# Altium schematic sheet Interface.SchDoc
size A4; SheetNumber: 4; SheetTotal: 4
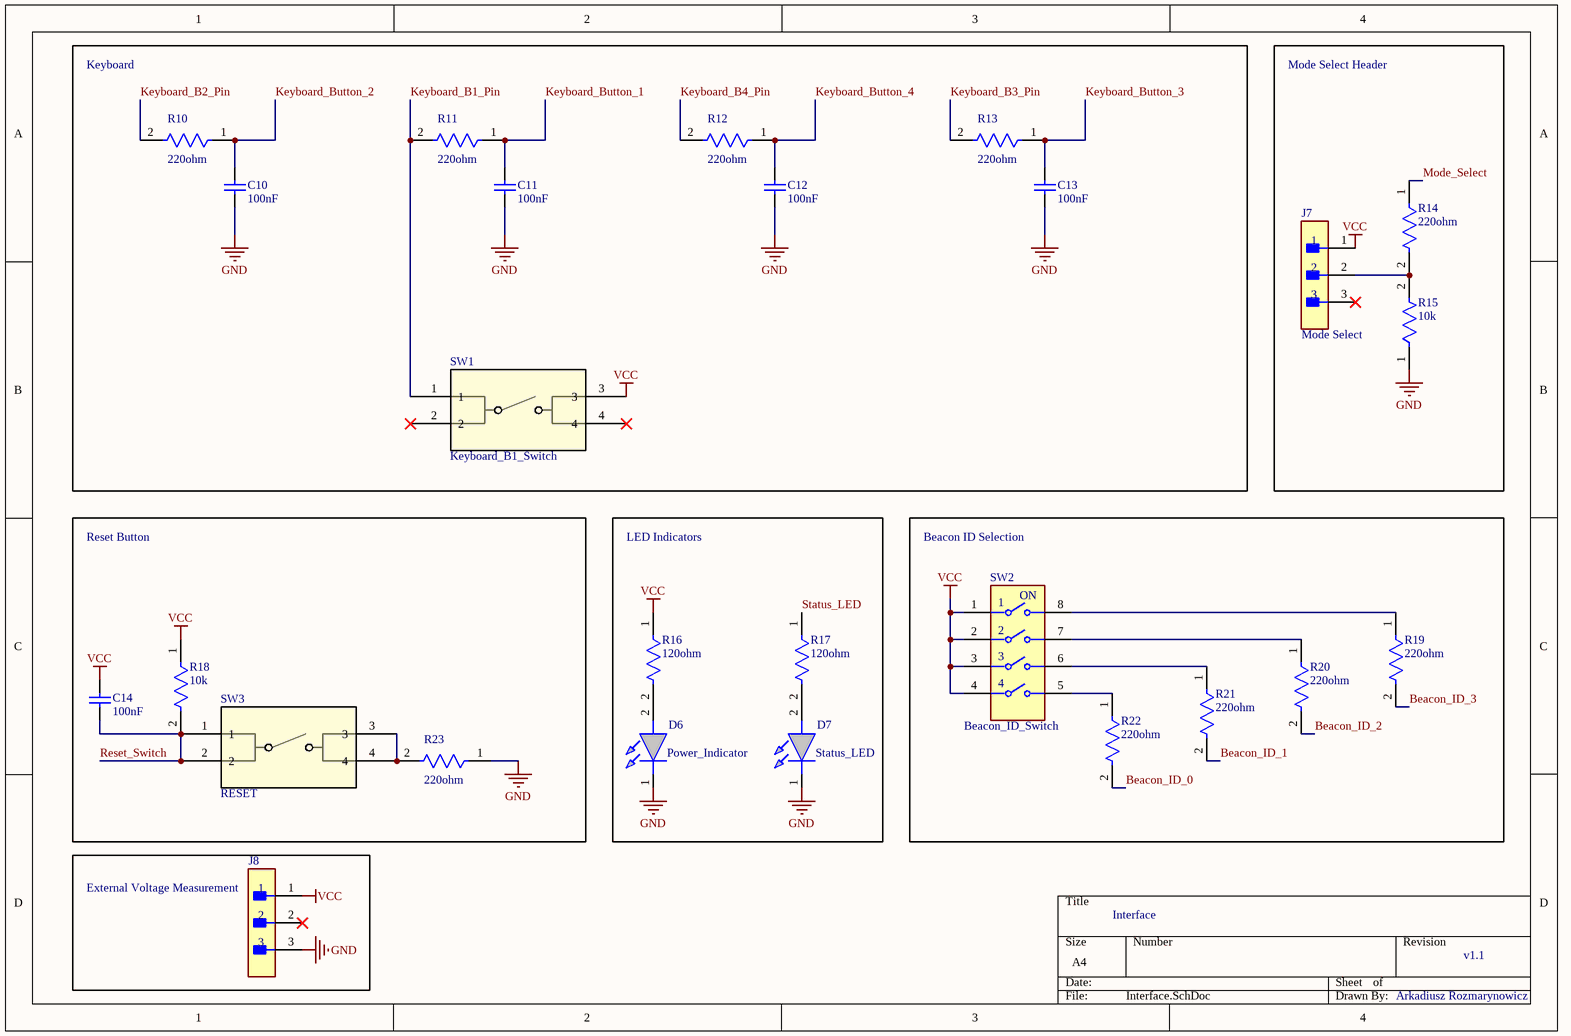
[diagram p0: Interface.SchDoc]

## Parts
C10  100nF  [CAPC2013X145X48NL20T23]
C11  100nF  [CAPC2013X145X48NL20T23]
C12  100nF  [CAPC2013X145X48NL20T23]
C13  100nF  [CAPC2013X145X48NL20T23]
C14  100nF  [CAPC2013X145X48NL20T23]
D6  Power_Indicator  [LEDC2012X40N]
D7  Status_LED  [LEDC2012X40N]
J7  Mode Select  [FP-TMM-103-03-T-S-MFG]
J8  External Voltage Measurement  [FP-TMM-103-03-T-S-MFG]
R10  220ohm  [FP-CRGCQ0805-IPC_C]
R11  220ohm  [FP-CRGCQ0805-IPC_C]
R12  220ohm  [FP-CRGCQ0805-IPC_C]
R13  220ohm  [FP-CRGCQ0805-IPC_C]
R14  220ohm  [FP-CRGCQ0805-IPC_C]
R15  10k  [FP-CRGCQ0805-IPC_C]
R16  120ohm  [FP-CRGCQ0805-IPC_C]
R17  120ohm  [FP-CRGCQ0805-IPC_C]
R18  10k  [FP-CRGCQ0805-IPC_C]
R19  220ohm  [FP-CRGCQ0805-IPC_C]
R20  220ohm  [FP-CRGCQ0805-IPC_C]
R21  220ohm  [FP-CRGCQ0805-IPC_C]
R22  220ohm  [FP-CRGCQ0805-IPC_C]
R23  220ohm  [FP-CRGCQ0805-IPC_C]
SW1  Keyboard_B1_Switch  [SW4_FSM-5P23_TEC]
SW2  Beacon_ID_Switch  [FP-A6S-4104-H-MFG]
SW3  RESET  [SW4_FSM-5P23_TEC]

## Blocks framed on the sheet
Keyboard: C10-C13 R10-R13 SW1
Mode Select Header: J7 R14 R15
LED Indicators: D6 D7 R16 R17
Beacon ID Selection: R19-R22 SW2

## Nets
GND: C10.1 C11.1 C12.1 C13.1 D6.1(K) D7.1(K) J8.3 R15.1 R23.1
VCC: C14.2 J7.1 J8.1 R16.1 R18.1 SW1.3 SW2.1 SW2.2 SW2.3 SW2.4
Beacon_ID_0: R22.2
Beacon_ID_1: R21.2
Beacon_ID_2: R20.2
Beacon_ID_3: R19.2
Keyboard_B1_Pin: R11.2 SW1.1
Keyboard_B2_Pin: R10.2
Keyboard_B3_Pin: R13.2
Keyboard_B4_Pin: R12.2
Keyboard_Button_1: C11.2 R11.1
Keyboard_Button_2: C10.2 R10.1
Keyboard_Button_3: C13.2 R13.1
Keyboard_Button_4: C12.2 R12.1
Mode_Select: R14.1
Reset_Switch: C14.1 R18.2 SW3.1 SW3.2
Status_LED: R17.1
NetD6_2: D6.2(A) R16.2
NetD7_2: D7.2(A) R17.2
NetJ7_2: J7.2 R14.2 R15.2
NetR19_1: R19.1 SW2.8
NetR20_1: R20.1 SW2.7
NetR21_1: R21.1 SW2.6
NetR22_1: R22.1 SW2.5
NetR23_2: R23.2 SW3.3 SW3.4

Not connected (* = marked no-connect by the designer): J7 3*; J8 2*; SW1 2* 4*

## Notes on the sheet
- Reset Button
- Interface
- v1.1
- Arkadiusz Rozmarynowicz
- (in symbol CMP-08827-000006-1) ON

## Library data of the parts
C10-C14 = CMP-2007-01705-1: Part Number: VJ0805Y104KXAMR; Manufacturer: Vitramon
D6 D7 = LS_R976: Red 0805 CHIPLED LS R976N-R102 Osram Opto LS R976, CHIPLED 0805 Series Red LED, 633 nm, 2012 (0805), Rectangle Lens SMD Package; Manufacturer_Name: ams OSRAM; Manufacturer_Part_Number: LS R976; Geometry.Height: 0.4mm; Mouser Part Number: 720-LSR976D5178; Mouser Price/Stock: https://www.mouser.co.uk/ProductDetail/OSRAM-Opto-Semiconductors/LS-R976?qs=OIr7YF%252B2cWVTfzKl425Fkw%3D%3D; Arrow Part Number: LS R976; Arrow Price/Stock: https://www.arrow.com/en/products/lsr976/osram-opto-semiconductors?region=europe; Datasheet Link: http://uk.rs-online.com/web/p/products/4974804
J7 J8 = CMP-02766-001695-1: CONN HEADER VERT 3POS 2MM; Gender: Male; Number of Positions: 3; Max Current Rating: 3.9A; Max Voltage Rating (AC): 500V; Packaging: Bulk; RoHS Compliant: Yes; Mount: Through Hole; Length: 6mm; Contact Type: Male Pin; Package Quantity: 1; Depth: 1.97mm; Contact Material: Bronze; Insulation Material: Polymer; Series: TMM; Contact Plating: Tin; Fastening Type: Pull; Housing Color: Black; Pitch: 2mm; Termination: Solder; Contact Mating Length: 0.157inch; Min Operating Temperature: -55°C; REACH SVHC: No SVHC; Orientation: Straight; Number of Rows: 1; Color: Black; Insulation Color: Black; Connector Type: Header; Radiation Hardening: No; Number of Contacts: 3; Lead Free: Lead Free; Contact Finish - Mating: TIN; Max Operating Temperature: 105°C; Housing Material: Polymer; Contact Shape: Square
R10-R13 R23 = CMP-03211-009742-1: CRGCQ0805 100KΩ 0.125W ±100ppm/°C 5% 150V; Manufacturer Part Number: CRGCQ0805J100K; Manufacturer: TE Connectivity; Resistance: 1k; Tolerance: 0.05; Temperature Range High: +155°C; Automotive Grade: Grade 1142; RoHS: TRUE; Package: CRGCQ0805; Octopart: https://octopart.com/crgcq0805j100k-te+connectivity-91018199; Device Class L1: Passive Components; Lead Free: Yes; Temperature: -55°C to +155°C; Category: Res; ComponentLink2Description: Datasheet; Power Rating: 0.125W; Ambient Temperature Range High: +70°C; Composition: Thick Film; Temperature Range Low: -55°C; Voltage Rating: 150V; Device Class L3: Chip SMD Resistors; Height: 0.65mm; Series: CRGCQ; Temperature Coefficient: ±100ppm/°C; Automotive: Yes; Device Class L2: Resistors; Ipc Land Pattern Name: RESC200125X55; ComponentLink2URL: https://www.te.com/commerce/DocumentDelivery/DDEController?Action=showdoc&DocId=Data+Sheet%7F1773204-3%7F1%7Fpdf%7FEnglish%7FENG_DS_1773204-3_1.pdf%7F4-2176341-1151; Value: 220ohm
R14 R19-R22 = CMP-03211-009742-1: CRGCQ0805 10KΩ 0.125W ±100ppm/°C 5% 150V; Manufacturer Part Number: CRGCQ0805J100K; Manufacturer: TE Connectivity; Resistance: 10k; Tolerance: 0.05; Temperature Range High: +155°C; Automotive Grade: Grade 1142; RoHS: TRUE; Package: CRGCQ0805; Octopart: https://octopart.com/crgcq0805j100k-te+connectivity-91018199; Device Class L1: Passive Components; Lead Free: Yes; Temperature: -55°C to +155°C; Category: Res; ComponentLink2Description: Datasheet; Power Rating: 0.125W; Ambient Temperature Range High: +70°C; Composition: Thick Film; Temperature Range Low: -55°C; Voltage Rating: 150V; Device Class L3: Chip SMD Resistors; Height: 0.65mm; Series: CRGCQ; Temperature Coefficient: ±100ppm/°C; Automotive: Yes; Device Class L2: Resistors; Ipc Land Pattern Name: RESC200125X55; ComponentLink2URL: https://www.te.com/commerce/DocumentDelivery/DDEController?Action=showdoc&DocId=Data+Sheet%7F1773204-3%7F1%7Fpdf%7FEnglish%7FENG_DS_1773204-3_1.pdf%7F4-2176341-1151; Value: 220ohm
R15 R18 = CMP-03211-009742-1: CRGCQ0805 10KΩ 0.125W ±100ppm/°C 5% 150V; Manufacturer Part Number: CRGCQ0805J100K; Manufacturer: TE Connectivity; Tolerance: 0.05; Temperature Range High: +155°C; Resistance: 10k; Automotive Grade: Grade 1142; RoHS: TRUE; Package: CRGCQ0805; Octopart: https://octopart.com/crgcq0805j100k-te+connectivity-91018199; Device Class L1: Passive Components; Lead Free: Yes; Temperature: -55°C to +155°C; Category: Res; ComponentLink2Description: Datasheet; Power Rating: 0.125W; Ambient Temperature Range High: +70°C; Composition: Thick Film; Temperature Range Low: -55°C; Voltage Rating: 150V; Device Class L3: Chip SMD Resistors; Height: 0.65mm; Series: CRGCQ; Temperature Coefficient: ±100ppm/°C; Automotive: Yes; Device Class L2: Resistors; Ipc Land Pattern Name: RESC200125X55; ComponentLink2URL: https://www.te.com/commerce/DocumentDelivery/DDEController?Action=showdoc&DocId=Data+Sheet%7F1773204-3%7F1%7Fpdf%7FEnglish%7FENG_DS_1773204-3_1.pdf%7F4-2176341-1151; Value: 10k
R16 R17 = CMP-03211-009742-1: CRGCQ0805 100KΩ 0.125W ±100ppm/°C 5% 150V; Manufacturer Part Number: CRGCQ0805J100K; Manufacturer: TE Connectivity; Resistance: 120; Tolerance: 0.05; Value: 120; Temperature Range High: +155°C; Automotive Grade: Grade 1142; RoHS: TRUE; Package: CRGCQ0805; Octopart: https://octopart.com/crgcq0805j100k-te+connectivity-91018199; Device Class L1: Passive Components; Lead Free: Yes; Temperature: -55°C to +155°C; Category: Res; ComponentLink2Description: Datasheet; Power Rating: 0.125W; Ambient Temperature Range High: +70°C; Composition: Thick Film; Temperature Range Low: -55°C; Voltage Rating: 150V; Device Class L3: Chip SMD Resistors; Height: 0.65mm; Series: CRGCQ; Temperature Coefficient: ±100ppm/°C; Automotive: Yes; Device Class L2: Resistors; Ipc Land Pattern Name: RESC200125X55; ComponentLink2URL: https://www.te.com/commerce/DocumentDelivery/DDEController?Action=showdoc&DocId=Data+Sheet%7F1773204-3%7F1%7Fpdf%7FEnglish%7FENG_DS_1773204-3_1.pdf%7F4-2176341-1151
SW1 SW3 = 1571563-4: FSM4JSMAATR=TACTSWITCH,SMT,T&R; Manufacturer_Name: TE Connectivity; Copyright: Copyright (C) 2025 Ultra Librarian. All rights reserved.; Manufacturer_Part_Number: 1571563-4; RefDes: RefDes; Type: Type
SW2 = CMP-08827-000006-1: SWITCH SLIDE DIP SPST 25MA 24V; Manufacturer Part Number: A6S-4104-H; Manufacturer: Omron Electronics Inc-EMC Div; Number Of Circuits: 4; Electromechanical Life: 1000Cycles; Contact Resistance: 200mΩ; Standoff Height: 0.7mm; Device Class L3: DIP Switches; Throw Configuration: SPST; Mouser Description: DIP Switches / SIP Switches Dip Switch; Device Class L2: Switches; Ambient Temperature Range Low: -20°C; Temperature: -20°C to +70°C; Digikey Description: SWITCH SLIDE DIP SPST 25MA 24V; Temperature Range Low: -20°C; Octopart: https://octopart.com/a6s-4104-h-omron-1480027; Package: 0; Device Class L1: Electromechanical; ComponentLink2URL: https://omronfs.omron.com/en_US/ecb/products/pdf/en-a6s.pdf; Temperature Range High: +70°C; Mount: Surface Mount; Voltage Rating Dc: 24V; Automotive: No; RoHS: TRUE; Category: Switch; ComponentLink2Description: Datasheet; Lead Free: Yes; Height: 4.5mm; Ambient Temperature Range High: +70°C; Contact Current Rating: 25mA